# EAGLE design ReelyUsefulPcb-4Blocks-v2-18mm (EAGLE 7.4.0)
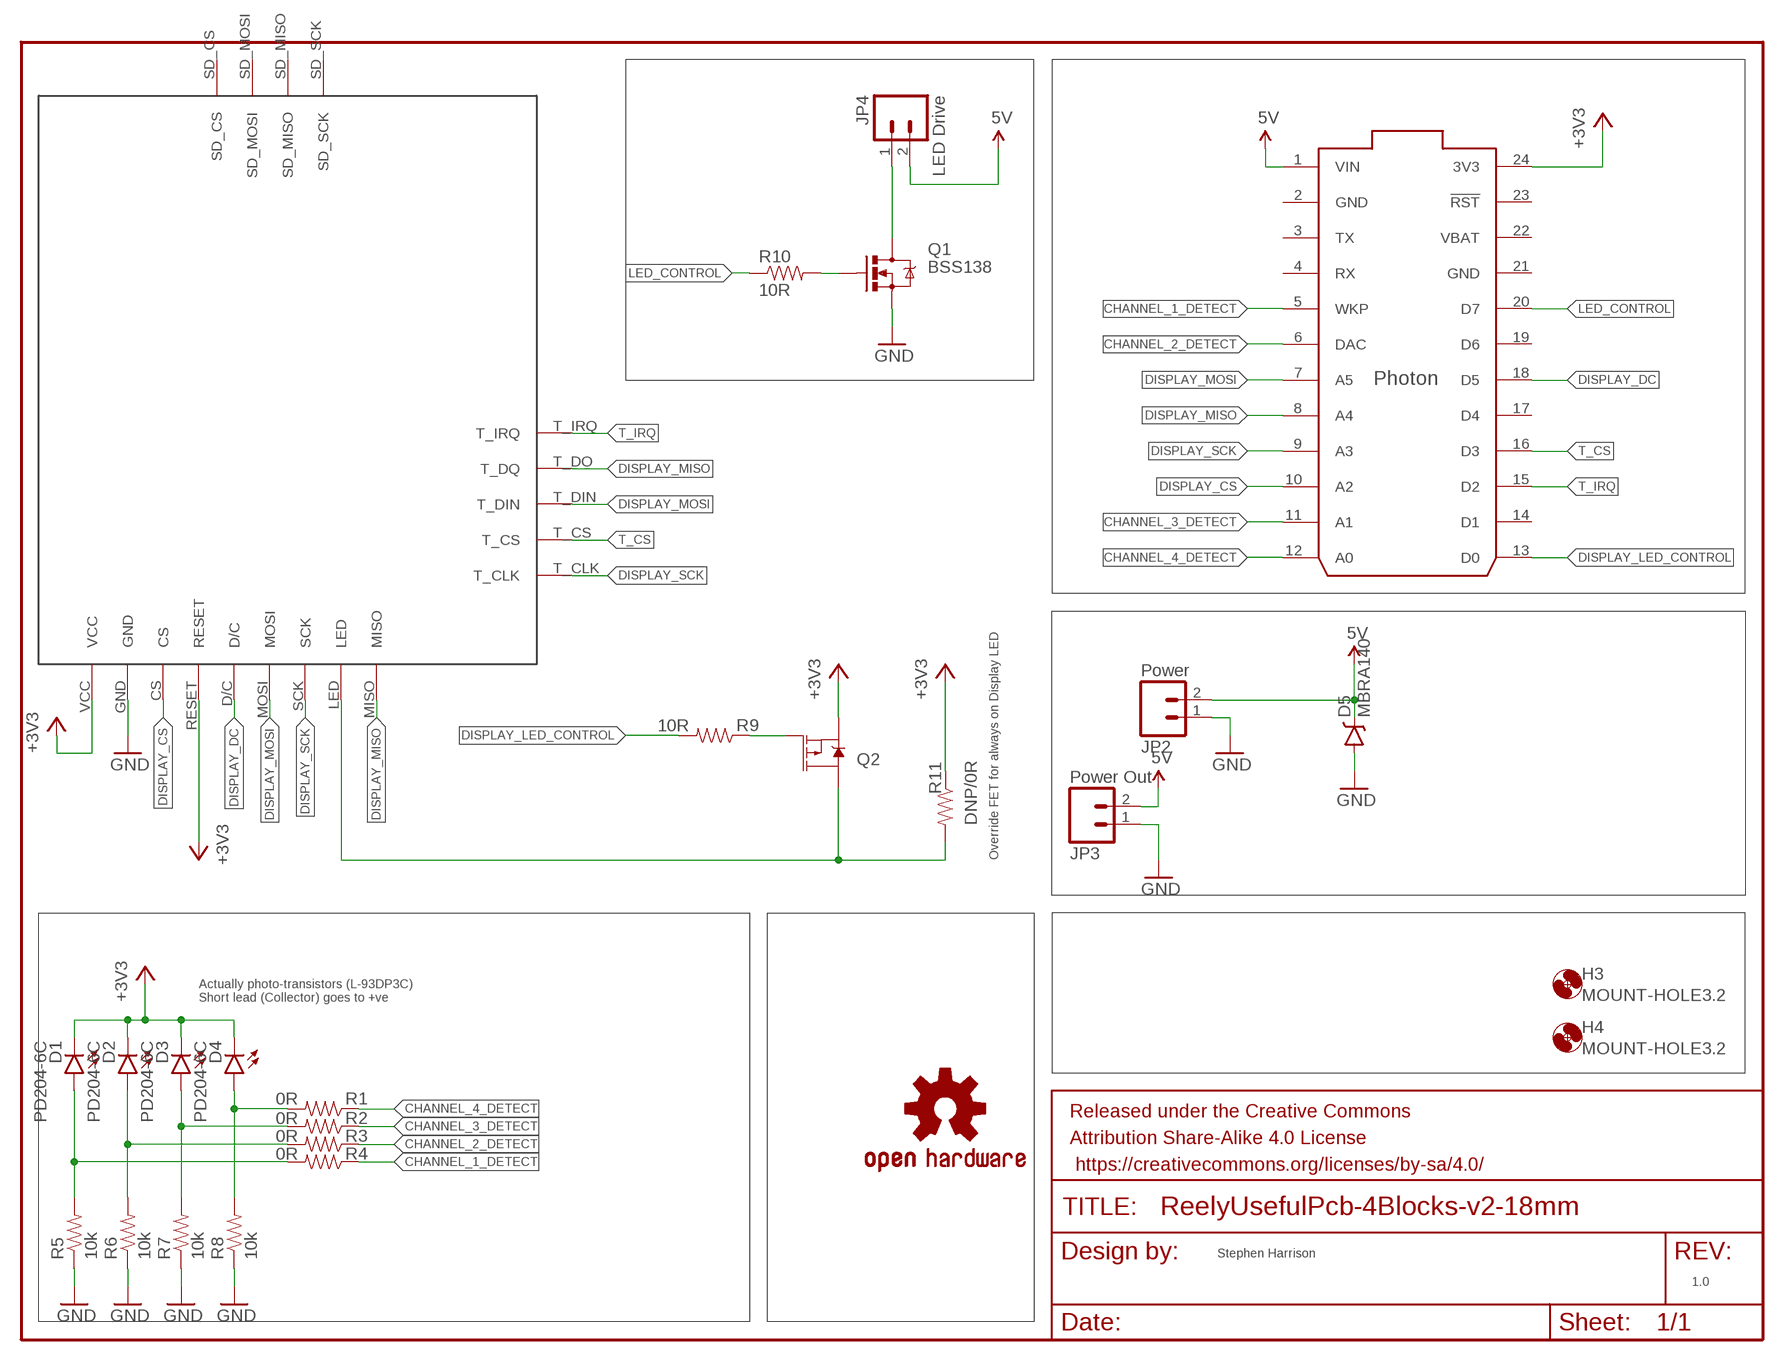
[diagram p0: schematic, sheet 1]

## Parts
D1  PD204-6C  LED3MM  [LED3MM]
D2  PD204-6C  LED3MM  [LED3MM]
D3  PD204-6C  LED3MM  [LED3MM]
D4  PD204-6C  LED3MM  [LED3MM]
D5  MBRA140  [SMA-DIODE]
FRAME1  FRAME-LETTER  [CREATIVE_COMMONS]
H3  MOUNT-HOLE3.2  [3,2]
H4  MOUNT-HOLE3.2  [3,2]
JP2  Power  M02-JST-2MM-SMT  [JST-2-SMD]
JP3  Power Out  M02-JST-2MM-SMT  [JST-2-SMD]
JP4  LED Drive  M02-JST-2MM-SMT  [JST-2-SMD]
LOGO1  OSHW-LOGOL  [OSHW-LOGO-L]
Q1  BSS138  MOSFET-NCHANNELBSS138  [SOT23-3@1]
Q2  2.5A/30V/105mΩ  MOSFET_PCH-DMG2307L  [SOT23-3]
R1  0R  RESISTOR1206  [1206]
R2  0R  RESISTOR1206  [1206]
R3  0R  RESISTOR1206  [1206]
R4  0R  RESISTOR1206  [1206]
R5  10k  RESISTOR1206  [1206]
R6  10k  RESISTOR1206  [1206]
R7  10k  RESISTOR1206  [1206]
R8  10k  RESISTOR1206  [1206]
R9  10R  RESISTOR1206  [1206]
R10  10R  RESISTOR1206  [1206]
R11  DNP/0R  RESISTOR1206  [1206]
U2  TJCTM240NO-MOUNTING-HOMES  [TJCTM240-NOHOLES]
U3  PHOTON_SMD  [PHOTON_SMD]

## Nets
5V: D5.C JP2.2 JP3.2 JP4.2 U3.1(VIN)
+3V3: D1.K(C) D2.K(C) D3.K(C) D4.K(C) Q2.2(S) R11.1 U2.RESET U2.VCC U3.24(3V3)
CHANNEL_1: D1.A R4.2 R5.2
CHANNEL_1_DETECT: R4.1 U3.5(WKP)
CHANNEL_2: D2.A R3.2 R6.2
CHANNEL_2_DETECT: R3.1 U3.6(DAC)
CHANNEL_3: D3.A R2.2 R7.2
CHANNEL_3_DETECT: R2.1 U3.11(A1)
CHANNEL_4: D4.A R1.2 R8.2
CHANNEL_4_DETECT: R1.1 U3.12(A0)
DISPLAY_CS: U2.CS U3.10(A2)
DISPLAY_DC: U2.D/C U3.18(D5)
DISPLAY_LED_CONTROL: R9.2 U3.13(D0)
DISPLAY_MISO: U2.MISO U2.T_DO(T_DQ) U3.8(A4)
DISPLAY_MOSI: U2.MOSI U2.T_DIN U3.7(A5)
DISPLAY_SCK: U2.SCK U2.T_CLK U3.9(A3)
GND: D5.A JP2.1 JP3.1 Q1.2(S) R5.1 R6.1 R7.1 R8.1 U2.GND
LED_CONTROL: R10.1 U3.20(D7)
N$2: JP4.1 Q1.3(D)
N$3: Q2.1(G) R9.1
N$5: Q1.1(G) R10.2
N$6: Q2.3(D) R11.2 U2.LED
T_CS: U2.T_CS U3.16(D3)
T_IRQ: U2.T_IRQ U3.15(D2)
Unconnected: U2.SD_CS U2.SD_MISO U2.SD_MOSI U2.SD_SCK U3.3(TX) U3.4(RX) U3.14(D1) U3.17(D4) U3.19(D6) U3.23(!RST) U3.25(EN) U3.26(!SETUP) U3.27(RGB_RED) U3.28(RGB_GREEN) U3.29(RGB_BLUE) U3.30(USB_D-) U3.31(USB_D+)

## Notes on the sheet
- Override FET for always on Display LED
- Actually photo-transistors (L-93DP3C)
  Short lead (Collector) goes to +ve
- Stephen Harrison
- 1.0

## Power pins joined to a net without a drawn wire
GND: U3.2(GND) U3.21(GND)
VBAT: U3.22(VBAT)

## Library data of the parts
D1-D4 = SparkFun-LED:LED: LEDs Standard schematic elements and footprints for 5mm, 3mm, 1206, and 0603 sized LEDs. 5mm - Spark Fun Electronics SKU : COM-00529 (and others); PROD_ID: DIO-08794
D5 = SparkFun-DiscreteSemi:MBRA140: 40V, 1A Schottky rectifier SMA/DO-214AC package DIO-08053; PROD_ID: DIO-08053
FRAME1 = SparkFun-Aesthetics:FRAME-LETTER: Schematic Frame Standard 8.5x11 US Letter frame
H3 H4 = holes:MOUNT-HOLE: MOUNTING HOLE with drill center marker
JP2-JP4 = SparkFun-Connectors:M02: Standard 2-pin 0.1" header. Use with - straight break away headers ( PRT-00116) - right angle break away headers (PRT-00553) - swiss pins (PRT-00743) - machine pins (PRT-00117) - female headers (PRT-00115) Molex polarized connector foot print use with: PRT-08233 with associated crimp pins and housings. 2.54_SCREWTERM for use with PRT-10571. 3.5mm Screw Terminal footprints for PRT-08084 5mm Screw Terminal footprints for use with PRT-08432; PROD_ID: CONN-11443
LOGO1 = SparkFun-Aesthetics:OSHW-LOGO: Open Source Hardware Logo This logo indicates the piece of hardware it is found on incorporates a OSHW license and/or adheres to the definition of open source hardware found here: http://freedomdefined.org/OSHW
Q1 = SparkFun-DiscreteSemi:MOSFET-NCHANNEL: Common NMOSFET Parts MFG P/N Store ID Prod ID FDD8780 TRANS-09984 SI7820DN TRANS-11055 FDS6630A IC-08089 2N7002PW TRANS-11151 FQP30N06L COM-10213 TRANS-10060 BSS123LT1G TRANS-08345 BSS138 TRANS-00830 BS170 2N7000; FARNELL: 9845330; PROD_ID: TRANS-00830; VALUE: 200mA/50V
Q2 = SparkFun-DiscreteSemi:MOSFET_PCH: P-channel MOSFETs Voltage controlled devices that allow control of high current outputs. SparkFun Products: SparkFun ESP32 Thing <https://www.sparkfun.com/products/13907> SparkFun ESP8266 Thing <https://www.sparkfun.com/products/13231>; PROD_ID: TRANS-11308
R1-R11 = SparkFun-Resistors:RESISTOR: Resistor Basic schematic elements and footprints for 0603, 1206, and PTH resistors.
U2 = 2.8InchTFT:TJCTM240: 2.8 tft spi 240*320 V1.1
U3 = Particle:PHOTON_SMD: Photon (without headers) - designed to be surface mounted with 7 extra exposed pads on the bottom of the board which include, 3 RGB LED outputs, /SETUP, EN (3.3V SMPS enable input), USB D+ and USB D-.

## Board
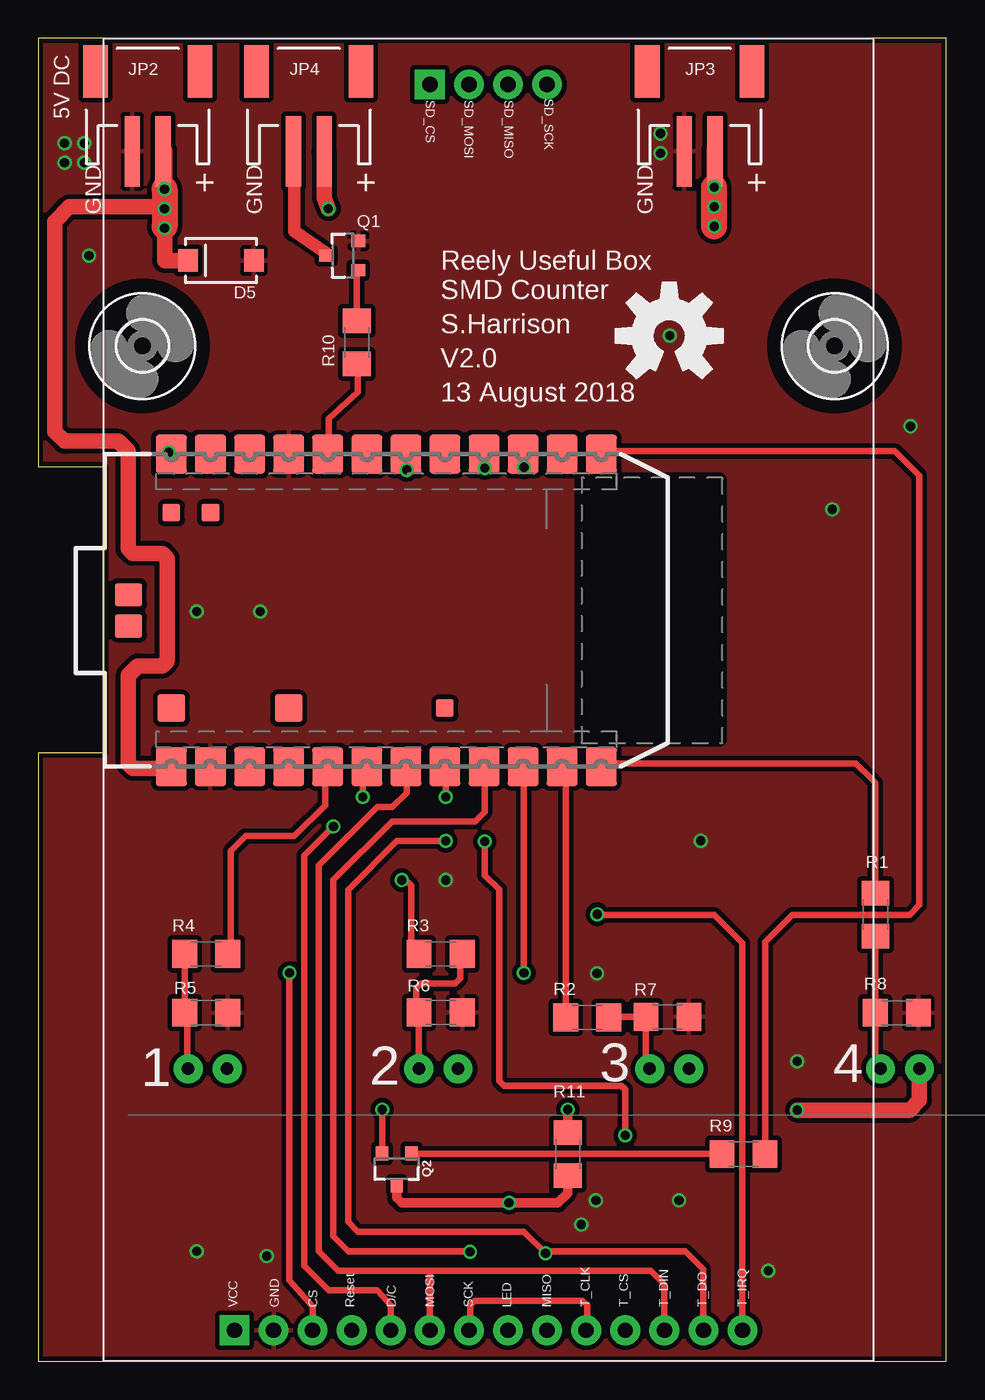
[diagram p1: board, top side]
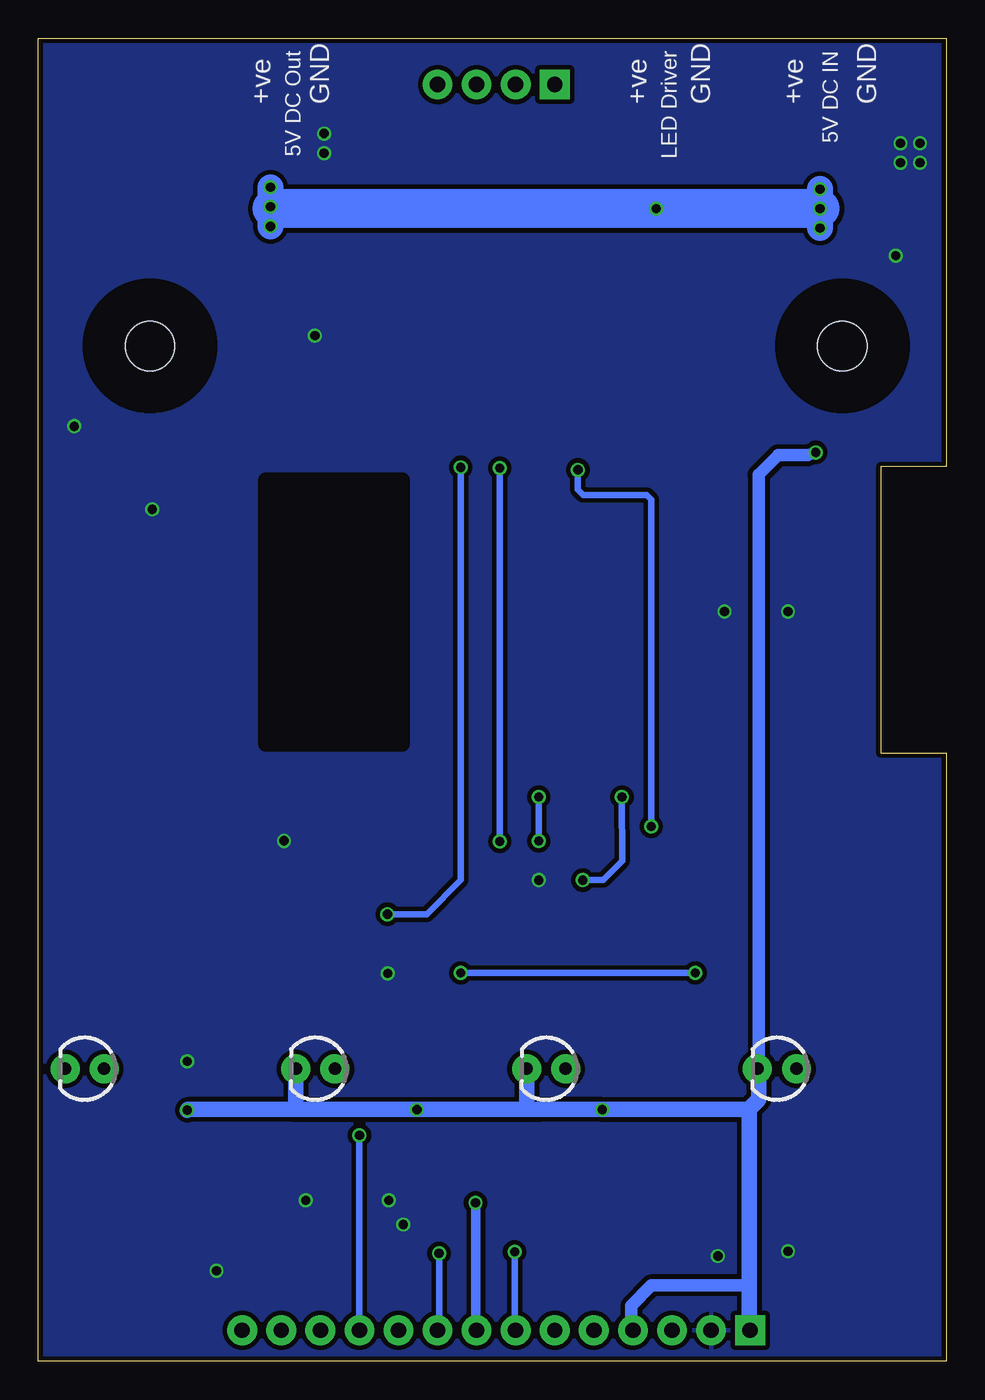
[diagram p2: board, bottom side, seen from below]

Size 59 x 86 mm. Coordinates in mm from the lower left corner, seen from the top.
Outline: 0,0 59,0 59,86 0,86 0,58.15 4.25,58.15 4.25,39.55 0,39.55 0,0
Copper layers (1*16): Top 0.035mm / dielectric 1.5mm / Bottom 0.035mm
Design rules "dirt_cheap_dirty_boards.v1": minimum track width 5mil, minimum drill 12mil, track to track 5mil, track to pad 5mil, pad to pad 5mil, via to via 5mil, smd to smd 0mil, copper to edge 10mil, drill to drill 10mil, minimum pad ring 10mil, minimum via ring 6mil, stop-mask expansion 2mil, vias tented up to drill 25mil, thermal gap 10mil
tRestrict: area 35.4,40.4 to 44.2,57.3
bRestrict: area 35.4,40.1 to 44.2,57.3

### Footprints (pad centres in the part's own frame; a part is rotated, then mirrored left to right if it is on the bottom)
LED3MM = drill 0.813 pad 1.88: A -1.27,0; K 1.27,0
SMA-DIODE = smd 1.27 x 1.47: A -2.15,0; C 2.15,0
3,2 = hole 3.2: 0,0
JST-2-SMD = smd 1 x 4.6: 1 -1,-3.7; 2 1,-3.7 | smd 1.6 x 3.4: NC1 -3.4,1.5; NC2 3.4,1.5
SOT23-3@1 = smd 0.8 x 0.9: 1 -0.95,-1; 2 0.95,-1; 3 0,1.1
SOT23-3 = smd 0.8 x 0.9: 1 -0.95,-1; 2 0.95,-1; 3 0,1.1
1206 = smd 1.6 x 1.8: 1 -1.4,0; 2 1.4,0
TJCTM240-NOHOLES = drill 1 pad 1.93: CS 13.57,2; D/C 18.65,2; GND 11.03,2; LED 26.27,2; MISO 28.81,2; MOSI 21.19,2; RESET 16.11,2; SCK 23.73,2; SD_MISO 26.27,83; SD_MOSI 23.73,83; SD_SCK 28.81,83; T_CLK 31.35,2; T_CS 33.89,2; T_DIN 36.43,2; T_DO 38.97,2; T_IRQ 41.51,2 | drill 1 pad 1.93 square: SD_CS 21.19,83; VCC 8.49,2
PHOTON_SMD = smd 2.54 x 2.032: 1 0,32.258; 2 0,29.718; 3 0,27.178; 4 0,24.638; 5 0,22.098; 6 0,19.558; 7 0,17.018; 8 0,14.478; 9 0,11.938; 10 0,9.398; 11 0,6.858; 12 0,4.318; 13 20.32,4.318; 14 20.32,6.858; 15 20.32,9.398; 16 20.32,11.938; 17 20.32,14.478; 18 20.32,17.018; 19 20.32,19.558; 20 20.32,22.098; 21 20.32,24.638; 22 20.32,27.178; 23 20.32,29.718; 24 20.32,32.258 | smd 1.778 x 1.778: 25 3.81,32.258; 26 3.81,24.638 | smd 1.143 x 1.143: 27 3.81,14.478; 28 16.51,29.718; 29 16.51,32.258 | smd 1.524 x 1.778: 30 11.176,35.052; 31 9.144,35.052

### Placement (x,y rotation side)
D1  11,19 180 bottom
D2  26,19 180 bottom
D3  41,19 180 bottom
D4  56,19 180 bottom
D5  11.86,71.56 180 top
FRAME1  11.2,-42.3 0 top  (outside the outline)
H3  6.75,66 0 top
H4  51.75,66 0 top
JP2  7.09,82.36 0 top
JP3  42.97,82.36 0 top
JP4  17.57,82.36 0 top
LOGO1  41,66.66 0 top
Q1  19.8,71.88 90 top
Q2  23.29,12.51 180 top
R1  54.4,29.02 270 top
R2  35.67,22.35 0 top
R3  26.14,26.48 0 top
R4  10.9,26.48 180 top
R5  10.9,22.65 180 top
R6  26.14,22.67 180 top
R7  40.88,22.38 180 top
R8  55.79,22.65 180 top
R9  45.83,13.46 0 top
R10  20.69,66.24 90 top
R11  34.4,13.46 270 top
U2  4.25,0 0 top
U3  40.9,38.65 90 top

### Tracks (layer width: path | path; a pad name or v marks a point on that pad's centre or on a via)
5V  (via drill 0.6)
  Top 0.813: 8.7,38.53 8.7,38.56 U3.1
  Top 1.016: 8.7,38.53 6.15,38.53 5.83,38.86 5.83,44.58 6.46,45.21 8.05,45.21 8.37,45.53 8.37,52.2 8.05,52.51 6.14,52.51 5.83,52.83 5.83,59.18 5.19,59.81 1.7,59.81 1.06,60.45 1.06,74.1 2.01,75.06 8.08,75.06 v8.2,74.94 | v43.92,75.06 v43.92,76.33 43.92,78.78 JP3.2 | v8.2,76.2 8.2,78.73 JP2.2 | JP4.2 18.58,75.62 v18.84,74.94 | 8.2,73.78 8.2,71.56 D5.C
  Top 1.676: v8.2,76.2 v8.2,74.94 8.2,73.78 | v43.92,73.78 v43.92,76.33
  Bottom 1.016: 43.8,74.94 v43.92,75.06
  Bottom 1.676: v8.2,73.66 v8.2,74.94 v8.2,76.2 | v43.92,76.33 v43.92,73.78
  Bottom 2.54: v8.2,74.94 v18.84,74.94 43.8,74.94
+3V3  (via drill 0.6)
  Top 0.406: Q2.2 22.34,15.71 v22.35,16.35
  Top 0.61: R11.1 v34.4,16.35
  Top 1.016: v8.47,59.09 8.47,59.14 U3.24 | v49.32,16.32 56.62,16.32 57.26,16.95 D4.K
  Bottom 0.813: v8.47,59.09 9.01,58.9 10.92,58.9 12.19,57.63 12.19,19.1 D1.K | 27.16,16.4 26.48,16.35 | 42.23,16.49 42.35,16.35 | D4.K | 12.74,2.94 U2.VCC 12.74,4.92 19.17,4.92 20.47,3.59 20.44,2.06 20.44,2.12 U2.RESET
  Bottom 1.016: v49.32,16.32 49.29,16.35 42.35,16.35 v34.4,16.35 26.48,16.35 v22.35,16.35 12.85,16.35 | D3.K 42.27,16.54 42.23,16.49 | D2.K 27.27,16.51 27.16,16.4 | D1.K 12.18,18.91 12.18,17.02 12.85,16.35 | 12.85,16.35 12.81,16.32 12.81,2.07 U2.VCC
CHANNEL_1
  Top 0.406: 9.82,22.6 R5.2 | R5.2 9.67,22.45 9.67,19.06 D1.A | R4.2 R5.2
CHANNEL_1_DETECT
  Top 0.406: U3.5 18.52,37.91 18.63,37.8 18.63,36.13 16.63,34.13 13.46,34.13 12.5,33.18 12.5,26.17 12.49,26.16 12.49,26.66 R4.1
CHANNEL_2
  Top 0.406: D2.A 24.73,23.13 24.56,23.3 | 24.56,23.3 24.56,22.72 R6.2 | 24.56,23.3 24.56,24.26 24.88,24.57 27.1,24.57 27.41,24.89 27.41,26.29 R3.2
CHANNEL_2_DETECT  (via drill 0.6)
  Top 0.406: 21.49,39.31 U3.6 21.08,38.39 v21.08,36.67 | v23.62,31.27 23.89,31.27 24.24,30.92 24.24,26.66 R3.1
  Bottom 0.406: v21.08,36.67 21.06,32.51 22.3,31.27 v23.62,31.27
CHANNEL_3
  Top 0.406: D3.A 39.48,19.25 R7.2 37.1,22.38 R2.2
CHANNEL_3_DETECT
  Top 0.406: 34.05,38.7 U3.11 34.27,38.42 R2.1
CHANNEL_4
  Top 0.406: R1.2 54.4,22.66 R8.2 54.39,19.34 D4.A
CHANNEL_4_DETECT
  Top 0.406: U3.12 36.64,38.85 53.14,38.85 54.09,37.91 54.4,37.59 R1.1
DISPLAY_CS  (via drill 0.6)
  Top 0.406: U2.CS 17.82,3.54 16.32,5.24 v16.32,25.24 | 31.36,38.35 U3.10 31.55,38.35 v31.55,25.24
  Bottom 0.406: v16.32,25.24 v31.55,25.24
DISPLAY_DC  (via drill 0.6)
  Top 0.406: U2.D/C 22.9,3.63 22.03,4.61 18.86,4.61 17.27,6.19 17.27,32.86 v19.17,34.77 | v23.94,57.95 23.88,58.82 U3.18
  Bottom 0.406: v19.17,34.77 19.17,53.18 19.16,56.01 19.48,56.32 23.61,56.32 23.94,56.65 v23.94,57.95
DISPLAY_LED_CONTROL
  Top 0.406: R9.2 47.23,27.24 49.01,29.02 56.62,29.02 57.26,29.65 57.26,57.59 55.67,59.18 36.79,59.18 U3.13
DISPLAY_MISO  (via drill 0.6)
  Top 0.406: 26.52,38.35 U3.8 26.48,38.6 v26.48,36.67 | v26.48,33.81 23.3,33.81 20.12,30.64 20.12,9.05 20.76,8.41 31.55,8.41 v32.96,7.01 33.09,7.14 42.03,7.14 43.2,5.97 43.2,2.02 U2.T_DO
  Bottom 0.406: v26.48,33.81 v26.48,36.67 | v32.96,7.01 32.96,1.5 U2.MISO
DISPLAY_MOSI
  Top 0.406: U3.7 23.84,39 23.94,38.26 23.92,36.95 23.01,36.04 22.03,36.04 18.22,32.23 18.22,7.14 19.49,5.88 25.51,5.88 | U2.T_DIN 40.68,5.01 39.81,5.88 25.51,5.88 | U2.MOSI 25.44,5.8 25.51,5.88
DISPLAY_SCK  (via drill 0.6)
  Top 0.406: U3.9 29.07,38.85 29,37.91 29.02,37.89 29.02,35.72 28.38,35.09 22.98,35.09 19.17,31.27 19.17,8.1 20.12,7.14 28.02,7.14 v28.05,7.11 | U2.T_CLK 35.67,2.07 35.67,3.62 35.35,3.94 28.37,3.94 28.06,3.63 28.06,2.08 U2.SCK
  Bottom 0.406: v28.05,7.11 28.05,2.07 U2.SCK
GND  (via drill 0.6)
  other vias: 10.28,48.74 36.3,25.21 49.32,19.49 14.84,6.82 43.04,33.83 56.68,60.78 26.48,31.27 41.03,66.67 10.28,7.14 47.43,5.88 2.97,77.91 1.7,77.91 1.7,79.18 40.43,79.82 40.43,78.55 36.23,10.46 14.41,48.74 2.97,79.18 3.29,71.88 35.28,8.87 41.63,10.46 51.6,55.38
  pour Bottom (isolate 0.305): -4.11,87.49 58.85,87.44 59.15,-2.59 -3.81,-2.54
  pour Top (isolate 0.305, rank 5): 6.78,87.44 58.95,87.14 59.05,-1.57 -2.94,-1.27 -3.04,87.44
LED_CONTROL
  Top 0.406: R10.1 20.75,64.84 20.75,62.99 18.86,61.3 18.86,60.62 U3.20
N$2
  Top 0.813: Q1.3 18.7,72.03 16.62,73.47 16.62,78.71 JP4.1
N$3
  Top 0.406: 24.24,13.46 R9.1
  Top 0.61: Q2.1 24.24,13.46
N$5
  Top 0.406: R10.2 20.69,70.83 Q1.1
N$6  (via drill 0.6)
  Top 0.61: R11.2 34.4,10.92 33.77,10.29 v30.59,10.29 23.61,10.29 23.29,10.6 Q2.3
  Bottom 0.61: v30.59,10.29 30.59,2.39 U2.LED
T_CS  (via drill 0.6)
  Top 0.406: v29.02,58.06 29.02,59.12 U3.16 | v38.14,14.67 38.14,17.66 37.89,17.91 30.27,17.91 29.95,18.22 29.95,30.65 29.02,31.59 v29.02,33.78
  Bottom 0.406: v29.02,33.78 v29.02,58.06 | U2.T_CS v38.14,14.67
T_IRQ  (via drill 0.6)
  Top 0.406: v31.55,58.12 31.41,59.62 U3.15 | U2.T_IRQ 45.76,27.18 43.92,29.02 36.35,29.02 v36.32,29.05
  Bottom 0.406: v36.32,29.05 33.78,29.05 31.55,31.27 v31.55,58.12

### Text on the board
tNames: 5V DC | + | + | + | GND | GND | GND | Reely Useful Box | SMD Counter | S.Harrison | V2.0 | 13 August 2018 | 1 | 2 | 3 | 4
bNames: 5V DC IN | LED Driver | 5V DC Out | GND | +ve | GND | +ve | GND | +ve
Measures: < Actual dispencer back edge | < Actual dispenser right hand edge (-0.25mm)
Reference: < Right hand edge | Left hand edge >
tDocu: Current block start | 1mm Gap between disppencer block and PCB